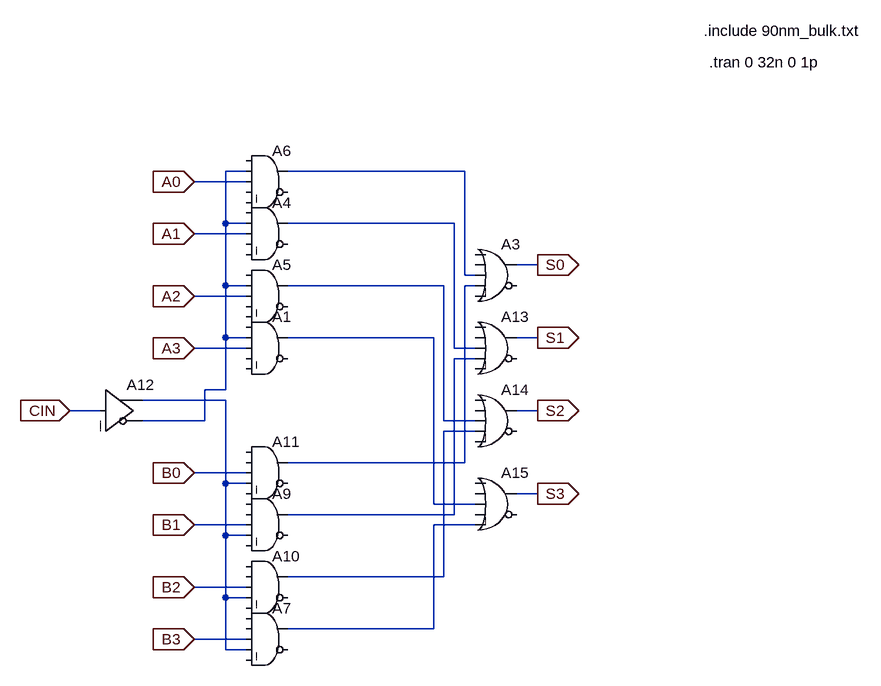
[diagram p0: schematic Multy.asc]
Multy.asc, the LTspice schematic file:
Version 4
SHEET 1 1080 776
WIRE 80 -80 48 -80
WIRE 416 -80 144 -80
WIRE 80 -64 0 -64
WIRE 48 0 48 -80
WIRE 80 0 48 0
WIRE 400 0 144 0
WIRE 80 16 0 16
WIRE 528 64 496 64
WIRE 416 80 416 -80
WIRE 432 80 416 80
WIRE 48 96 48 0
WIRE 80 96 48 96
WIRE 384 96 144 96
WIRE 432 96 416 96
WIRE 80 112 0 112
WIRE 48 176 48 96
WIRE 80 176 48 176
WIRE 368 176 144 176
WIRE 528 176 496 176
WIRE 80 192 0 192
WIRE 400 192 400 0
WIRE 432 192 400 192
WIRE 432 208 400 208
WIRE 48 256 48 176
WIRE 48 256 16 256
WIRE 48 272 -80 272
WIRE -144 288 -192 288
WIRE 528 288 496 288
WIRE 16 304 16 256
WIRE 16 304 -80 304
WIRE 384 304 384 96
WIRE 432 304 384 304
WIRE 432 320 384 320
WIRE 416 368 416 96
WIRE 416 368 144 368
WIRE 80 384 0 384
WIRE 48 400 48 272
WIRE 80 400 48 400
WIRE 528 416 496 416
WIRE 368 432 368 176
WIRE 432 432 368 432
WIRE 400 448 400 208
WIRE 400 448 144 448
WIRE 80 464 0 464
WIRE 432 464 368 464
WIRE 48 480 48 400
WIRE 80 480 48 480
WIRE 384 544 384 320
WIRE 384 544 144 544
WIRE 80 560 0 560
WIRE 48 576 48 480
WIRE 80 576 48 576
WIRE 368 624 368 464
WIRE 368 624 144 624
WIRE 80 640 0 640
WIRE 48 656 48 576
WIRE 80 656 48 656
FLAG 528 64 S0
IOPIN 528 64 Out
FLAG 528 176 S1
IOPIN 528 176 Out
FLAG 528 288 S2
IOPIN 528 288 Out
FLAG 528 416 S3
IOPIN 528 416 Out
FLAG -192 288 CIN
IOPIN -192 288 In
FLAG 0 384 B0
IOPIN 0 384 In
FLAG 0 464 B1
IOPIN 0 464 In
FLAG 0 560 B2
IOPIN 0 560 In
FLAG 0 640 B3
IOPIN 0 640 In
FLAG 0 192 A3
IOPIN 0 192 In
FLAG 0 112 A2
IOPIN 0 112 In
FLAG 0 16 A1
IOPIN 0 16 In
FLAG 0 -64 A0
IOPIN 0 -64 In
SYMBOL Digital\\and 112 128 R0
SYMATTR InstName A1
SYMBOL Digital\\and 112 -48 R0
SYMATTR InstName A4
SYMBOL Digital\\and 112 48 R0
SYMATTR InstName A5
SYMBOL Digital\\and 112 -128 R0
SYMATTR InstName A6
SYMBOL Digital\\and 112 576 R0
SYMATTR InstName A7
SYMBOL Digital\\and 112 400 R0
SYMATTR InstName A9
SYMBOL Digital\\and 112 496 R0
SYMATTR InstName A10
SYMBOL Digital\\and 112 320 R0
SYMATTR InstName A11
SYMBOL Digital\\buf -144 224 R0
SYMATTR InstName A12
SYMBOL Digital\\or 464 16 R0
SYMATTR InstName A3
SYMBOL Digital\\or 464 128 R0
SYMATTR InstName A13
SYMBOL Digital\\or 464 240 R0
SYMATTR InstName A14
SYMBOL Digital\\or 464 368 R0
SYMATTR InstName A15
TEXT 784 -296 Left 2 !.include 90nm_bulk.txt
TEXT 792 -248 Left 2 !.tran 0 32n 0 1p

The netlist it stands for:
* Multy.asc
A1 0 N001 A3 0 0 0 N006 0 AND
A4 0 N001 A1 0 0 0 N003 0 AND
A5 0 N001 A2 0 0 0 N004 0 AND
A6 0 N001 A0 0 0 0 N002 0 AND
A7 0 0 B3 N008 0 0 N010 0 AND
A9 0 0 B1 N008 0 0 N007 0 AND
A10 0 0 B2 N008 0 0 N009 0 AND
A11 0 0 B0 N008 0 0 N005 0 AND
A12 CIN 0 0 0 0 N001 N008 0 BUF
A3 0 0 N002 N005 0 0 S0 0 OR
A13 0 0 N003 N007 0 0 S1 0 OR
A14 0 0 N004 N009 0 0 S2 0 OR
A15 0 0 N006 0 N010 0 S3 0 OR
.include 90nm_bulk.txt
.tran 0 32n 0 1p
.backanno
.end